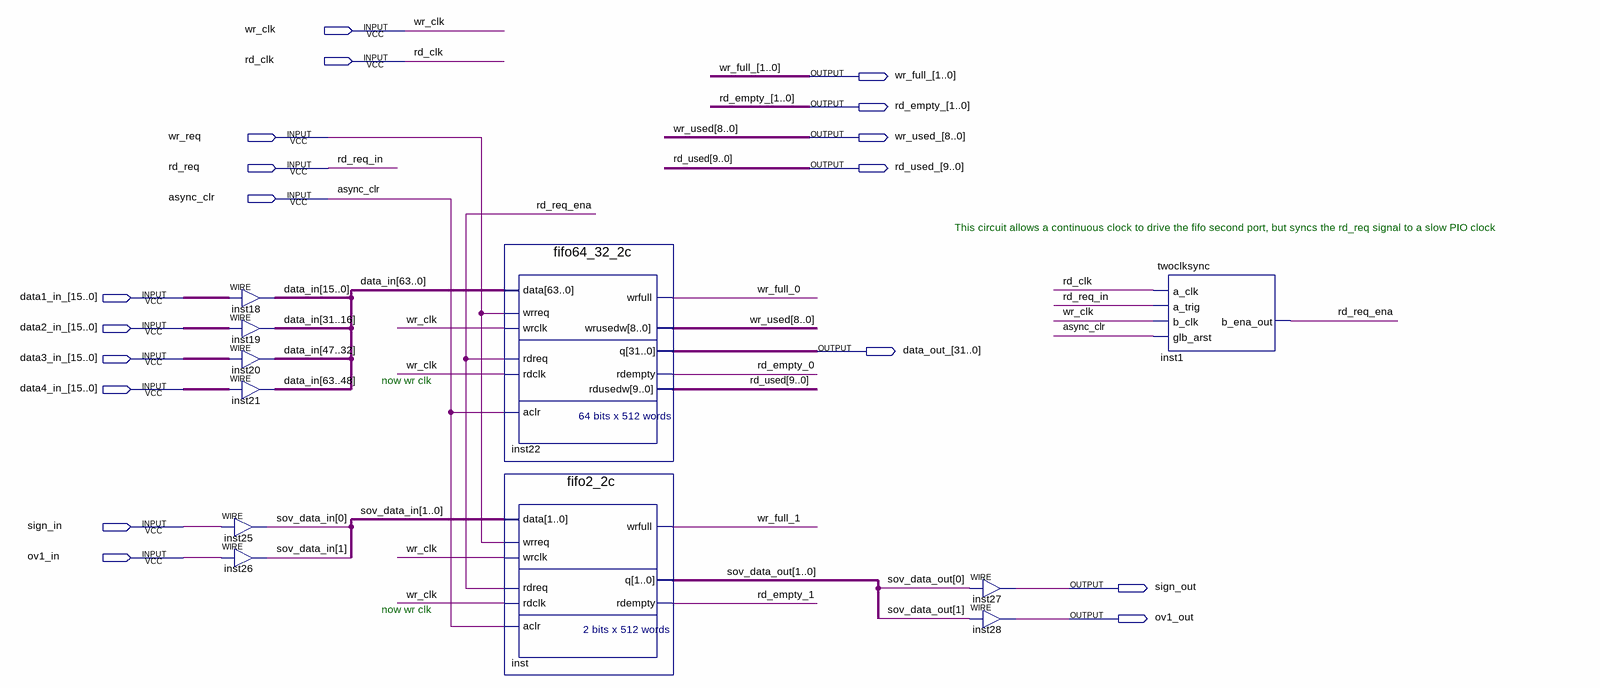
[diagram p0: schematic sheet]
// Quartus schematic fifo_fixpntint1.bdf as structural Verilog: 11 symbols, 18 pins
module fifo_fixpntint1 (
  input  wr_clk,
  input  rd_clk,
  input  wr_req,
  input  rd_req,
  input  async_clr,
  input  [15:0] data1_in_,
  input  [15:0] data2_in_,
  input  [15:0] data3_in_,
  input  [15:0] data4_in_,
  input  sign_in,
  input  ov1_in,
  output [1:0] wr_full_,
  output [1:0] rd_empty_,
  output [8:0] wr_used_,
  output [9:0] rd_used_,
  output [31:0] data_out_,
  output sign_out,
  output ov1_out
);

  wire rd_req_ena;
  wire [1:0] sov_data_in, sov_data_out;
  wire [63:0] data_in;

  assign data_in[15:0] = data1_in_;  // WIRE inst18
  assign data_in[31:16] = data2_in_;  // WIRE inst19
  assign data_in[47:32] = data3_in_;  // WIRE inst20
  assign data_in[63:48] = data4_in_;  // WIRE inst21
  assign sov_data_in[0] = sign_in;  // WIRE inst25
  assign sov_data_in[1] = ov1_in;  // WIRE inst26
  fifo64_32_2c inst22 (
    .data(data_in), .wrreq(wr_req), .wrclk(wr_clk), .rdreq(rd_req_ena), .rdclk(wr_clk), .aclr(async_clr),
    .wrfull(wr_full_[0]), .wrusedw(wr_used_), .q(data_out_), .rdempty(rd_empty_[0]), .rdusedw(rd_used_));
  fifo2_2c inst (
    .data(sov_data_in), .wrreq(wr_req), .wrclk(wr_clk), .rdreq(rd_req_ena), .rdclk(wr_clk), .aclr(async_clr),
    .wrfull(wr_full_[1]), .q(sov_data_out), .rdempty(rd_empty_[1]));
  assign sign_out = sov_data_out[0];  // WIRE inst27
  assign ov1_out = sov_data_out[1];  // WIRE inst28
  twoclksync inst1 (.a_clk(rd_clk), .b_clk(wr_clk), .glb_arst(async_clr), .a_trig(rd_req), .b_ena_out(rd_req_ena));

  // Other names for the same wires on the sheet: rd_req_in = rd_req; rd_used[9:0] = rd_used_; wr_used[8:0] = wr_used_

  // Notes on the sheet:
  //   This circuit allows a continuous clock to drive the fifo second port, but syncs the rd_req signal to a slow PIO clock
  //   now wr clk
  //   now wr clk
endmodule
